# EAGLE design shield (EAGLE 9.2.0)
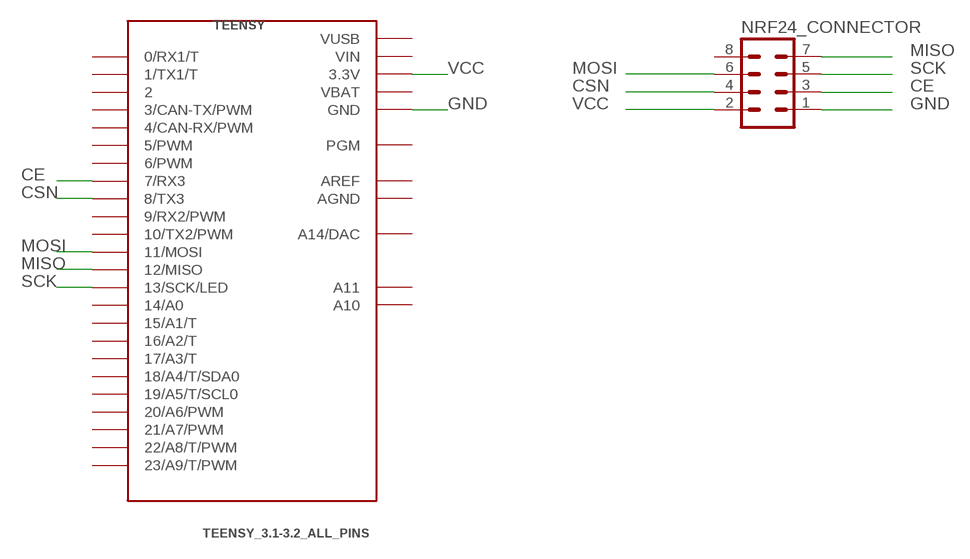
[diagram p0: schematic, sheet 1]

## Parts
NRF24_CONNECTOR  MA04-2  [MA04-2]
TEENSY  TEENSY_3.1-3.2_ALL_PINS  [TEENSY_3.0-3.2&LC_ALL_PINS]

## Nets
CE: NRF24_CONNECTOR.3 TEENSY.7(7/RX3)
CSN: NRF24_CONNECTOR.4 TEENSY.8(8/TX3)
GND: NRF24_CONNECTOR.1 TEENSY.GND TEENSY.GND1(GND)
MISO: NRF24_CONNECTOR.7 TEENSY.12(12/MISO)
MOSI: NRF24_CONNECTOR.6 TEENSY.11(11/MOSI)
SCK: NRF24_CONNECTOR.5 TEENSY.13(13/SCK/LED)
VCC: NRF24_CONNECTOR.2 TEENSY.3.3V TEENSY.3.3V1(3.3V)
Unconnected: NRF24_CONNECTOR.8 TEENSY.0(0/RX1/T) TEENSY.1(1/TX1/T) TEENSY.2 TEENSY.3(3/CAN-TX/PWM) TEENSY.4(4/CAN-RX/PWM) TEENSY.5(5/PWM) TEENSY.6(6/PWM) TEENSY.9(9/RX2/PWM) TEENSY.10(10/TX2/PWM) TEENSY.14/A0 TEENSY.15/A1(15/A1/T) TEENSY.16/A2(16/A2/T) TEENSY.17/A3(17/A3/T) TEENSY.18/A4(18/A4/T/SDA0) TEENSY.19/A5(19/A5/T/SCL0) TEENSY.20/A6(20/A6/PWM) TEENSY.21/A7(21/A7/PWM) TEENSY.22/A8(22/A8/T/PWM) TEENSY.23/A9(23/A9/T/PWM) TEENSY.A10 TEENSY.A11 TEENSY.PGM TEENSY.RESET/DAC(A14/DAC)

## Power pins joined to a net without a drawn wire
AGND: TEENSY.AGND
AREF: TEENSY.AREF
VBAT: TEENSY.VBAT
VIN: TEENSY.VIN
VUSB: TEENSY.VUSB

## Library data of the parts
NRF24_CONNECTOR = con-lstb:MA04-2: PIN HEADER; OC_FARNELL: unknown; OC_NEWARK: unknown
TEENSY = Teensy:TEENSY_3.1-3.2_ALL_PINS: Footprint for Teensy 3.1 or 3.2 board using all through-holes, i.e. the entire perimeter plus the 4 through-holes inboard (A10,A11,AREF, VUSB)

## Board
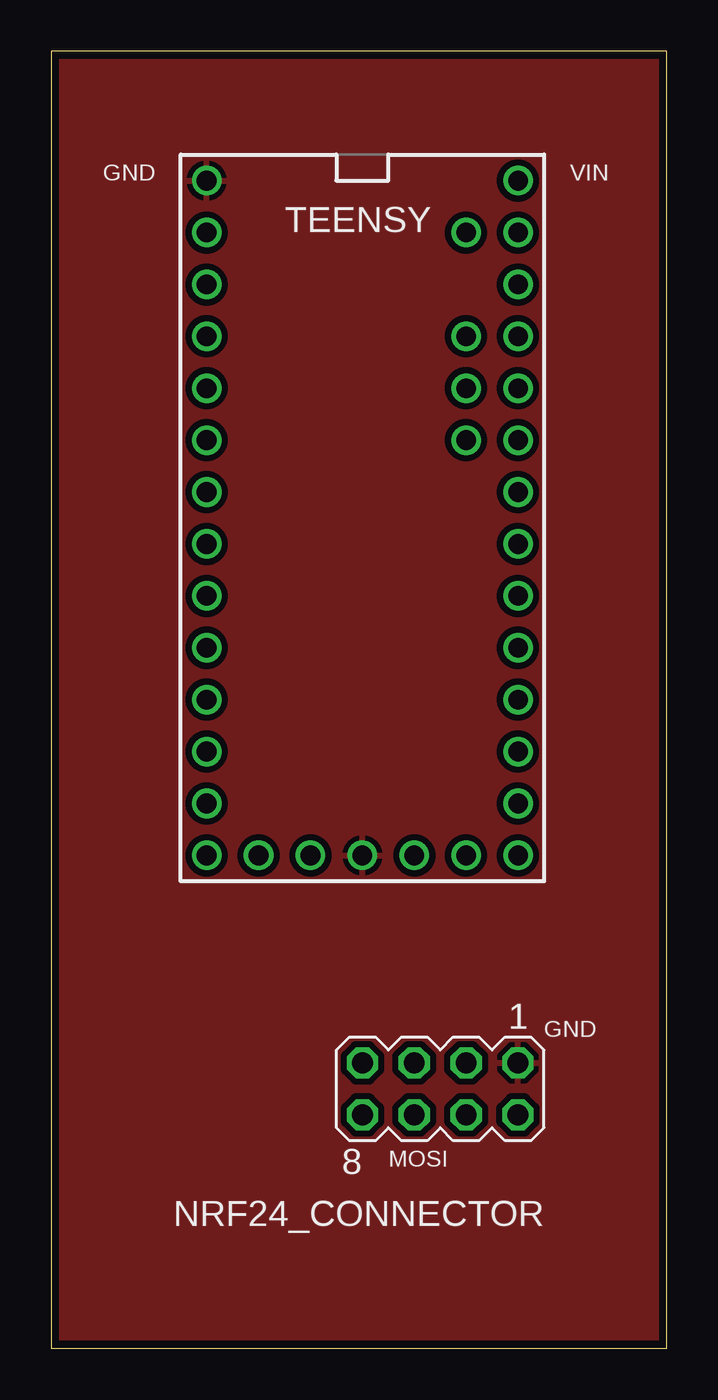
[diagram p1: board, top side]
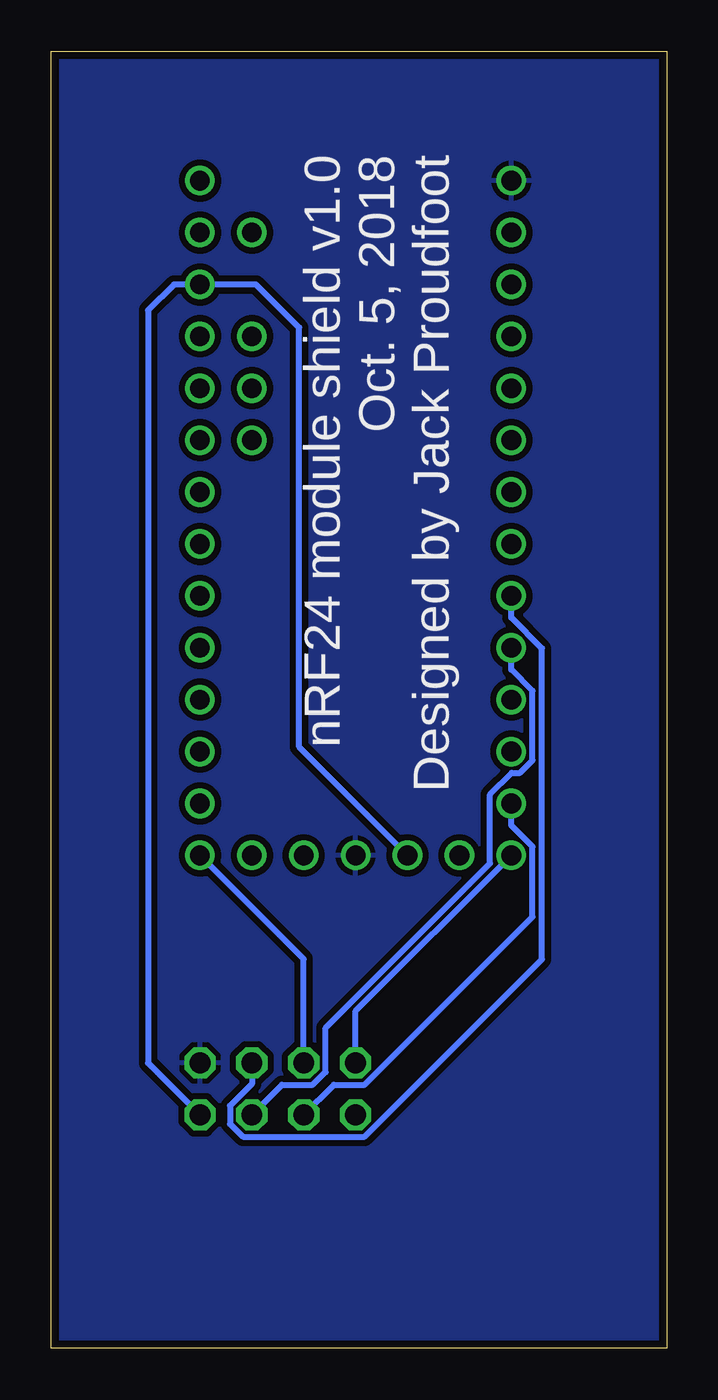
[diagram p2: board, bottom side, seen from below]

Size 30.15 x 63.49 mm. Coordinates in mm from the lower left corner, seen from the top.
Outline: 0,0 30.15,0 30.15,63.49 0,63.49 0,0
Copper layers (1*16): Top 0.0356mm / dielectric 1.5011mm / Bottom 0.0356mm
Design rules "jlcpcb": minimum track width 5mil, minimum drill 13mil, track to track 5mil, track to pad 5mil, pad to pad 5mil, via to via 5mil, smd to smd 5mil, copper to edge 15mil, drill to drill 6mil, minimum pad ring 7mil, minimum via ring 7mil, stop-mask expansion 2.5mil, vias tented up to drill 0mil, thermal gap 10mil

### Footprints (pad centres in the part's own frame; a part is rotated, then mirrored left to right if it is on the bottom)
MA04-2 = drill 1.016 octagon: 1 -3.81,-1.27; 2 -3.81,1.27; 3 -1.27,-1.27; 4 -1.27,1.27; 5 1.27,-1.27; 6 1.27,1.27; 7 3.81,-1.27; 8 3.81,1.27
TEENSY_3.0-3.2&LC_ALL_PINS = drill 0.965: 0 -7.62,13.97; 1 -7.62,11.43; 2 -7.62,8.89; 3 -7.62,6.35; 3.3V 7.62,11.43; 3.3V1 -2.54,-16.51; 4 -7.62,3.81; 5 -7.62,1.27; 6 -7.62,-1.27; 7 -7.62,-3.81; 8 -7.62,-6.35; 9 -7.62,-8.89; 10 -7.62,-11.43; 11 -7.62,-13.97; 12 -7.62,-16.51; 13 7.62,-16.51; 14/A0 7.62,-13.97; 15/A1 7.62,-11.43; 16/A2 7.62,-8.89; 17/A3 7.62,-6.35; 18/A4 7.62,-3.81; 19/A5 7.62,-1.27; 20/A6 7.62,1.27; 21/A7 7.62,3.81; 22/A8 7.62,6.35; 23/A9 7.62,8.89; A10 5.08,6.35; A11 5.08,3.81; AGND 7.62,13.97; AREF 5.08,8.89; GND -7.62,16.51; GND1 0,-16.51; PGM 2.54,-16.51; RESET/DAC 5.08,-16.51; VBAT -5.08,-16.51; VIN 7.62,16.51; VUSB 5.08,13.97

### Placement (x,y rotation side)
NRF24_CONNECTOR  19.05,12.7 180 top
TEENSY  15.24,40.64 0 top
U$1  [DEV]  3.81,16.51 0 top

### Tracks (layer width: path | path; a pad name or v marks a point on that pad's centre or on a via)
CE
  Bottom 0.305: TEENSY.7 7.62,35.76 6.12,34.26 6.12,19.04 14.8,10.36 20.76,10.36 21.39,10.99 21.39,11.87 20.32,12.94 NRF24_CONNECTOR.3
CSN
  Bottom 0.305: NRF24_CONNECTOR.4 18.85,12.9 17.34,12.9 16.71,13.53 16.71,15.68 8.66,23.73 8.66,27.1 7.59,28.17 7.19,28.17 6.58,28.78 6.58,32.18 7.62,33.22 TEENSY.8
GND
  pour Top (isolate 0.305): 0,63.5 30.48,63.5 30.48,0 0,0
  pour Bottom (isolate 0.305): 0,0 0,63.5 30.48,63.5 30.48,0
MISO
  Bottom 0.305: NRF24_CONNECTOR.7 15.24,16.51 TEENSY.12
MOSI
  Bottom 0.305: NRF24_CONNECTOR.6 16.31,12.9 14.8,12.9 6.58,21.12 6.58,24.56 7.62,25.6 TEENSY.11
SCK
  Bottom 0.305: NRF24_CONNECTOR.5 17.78,19.05 TEENSY.13
VCC
  Bottom 0.305: TEENSY.3.3V1 18.01,29.44 18.01,49.96 20.12,52.07 TEENSY.3.3V 24.13,52.07 25.4,50.8 25.4,13.97 NRF24_CONNECTOR.2

### Text on the board
tPlace: GND | VIN | GND | MOSI
bPlace: nRF24 module shield v1.0 / Oct. 5, 2018 / Designed by Jack Proudfoot